# EAGLE design USB_Isolator (EAGLE 7.7.0)
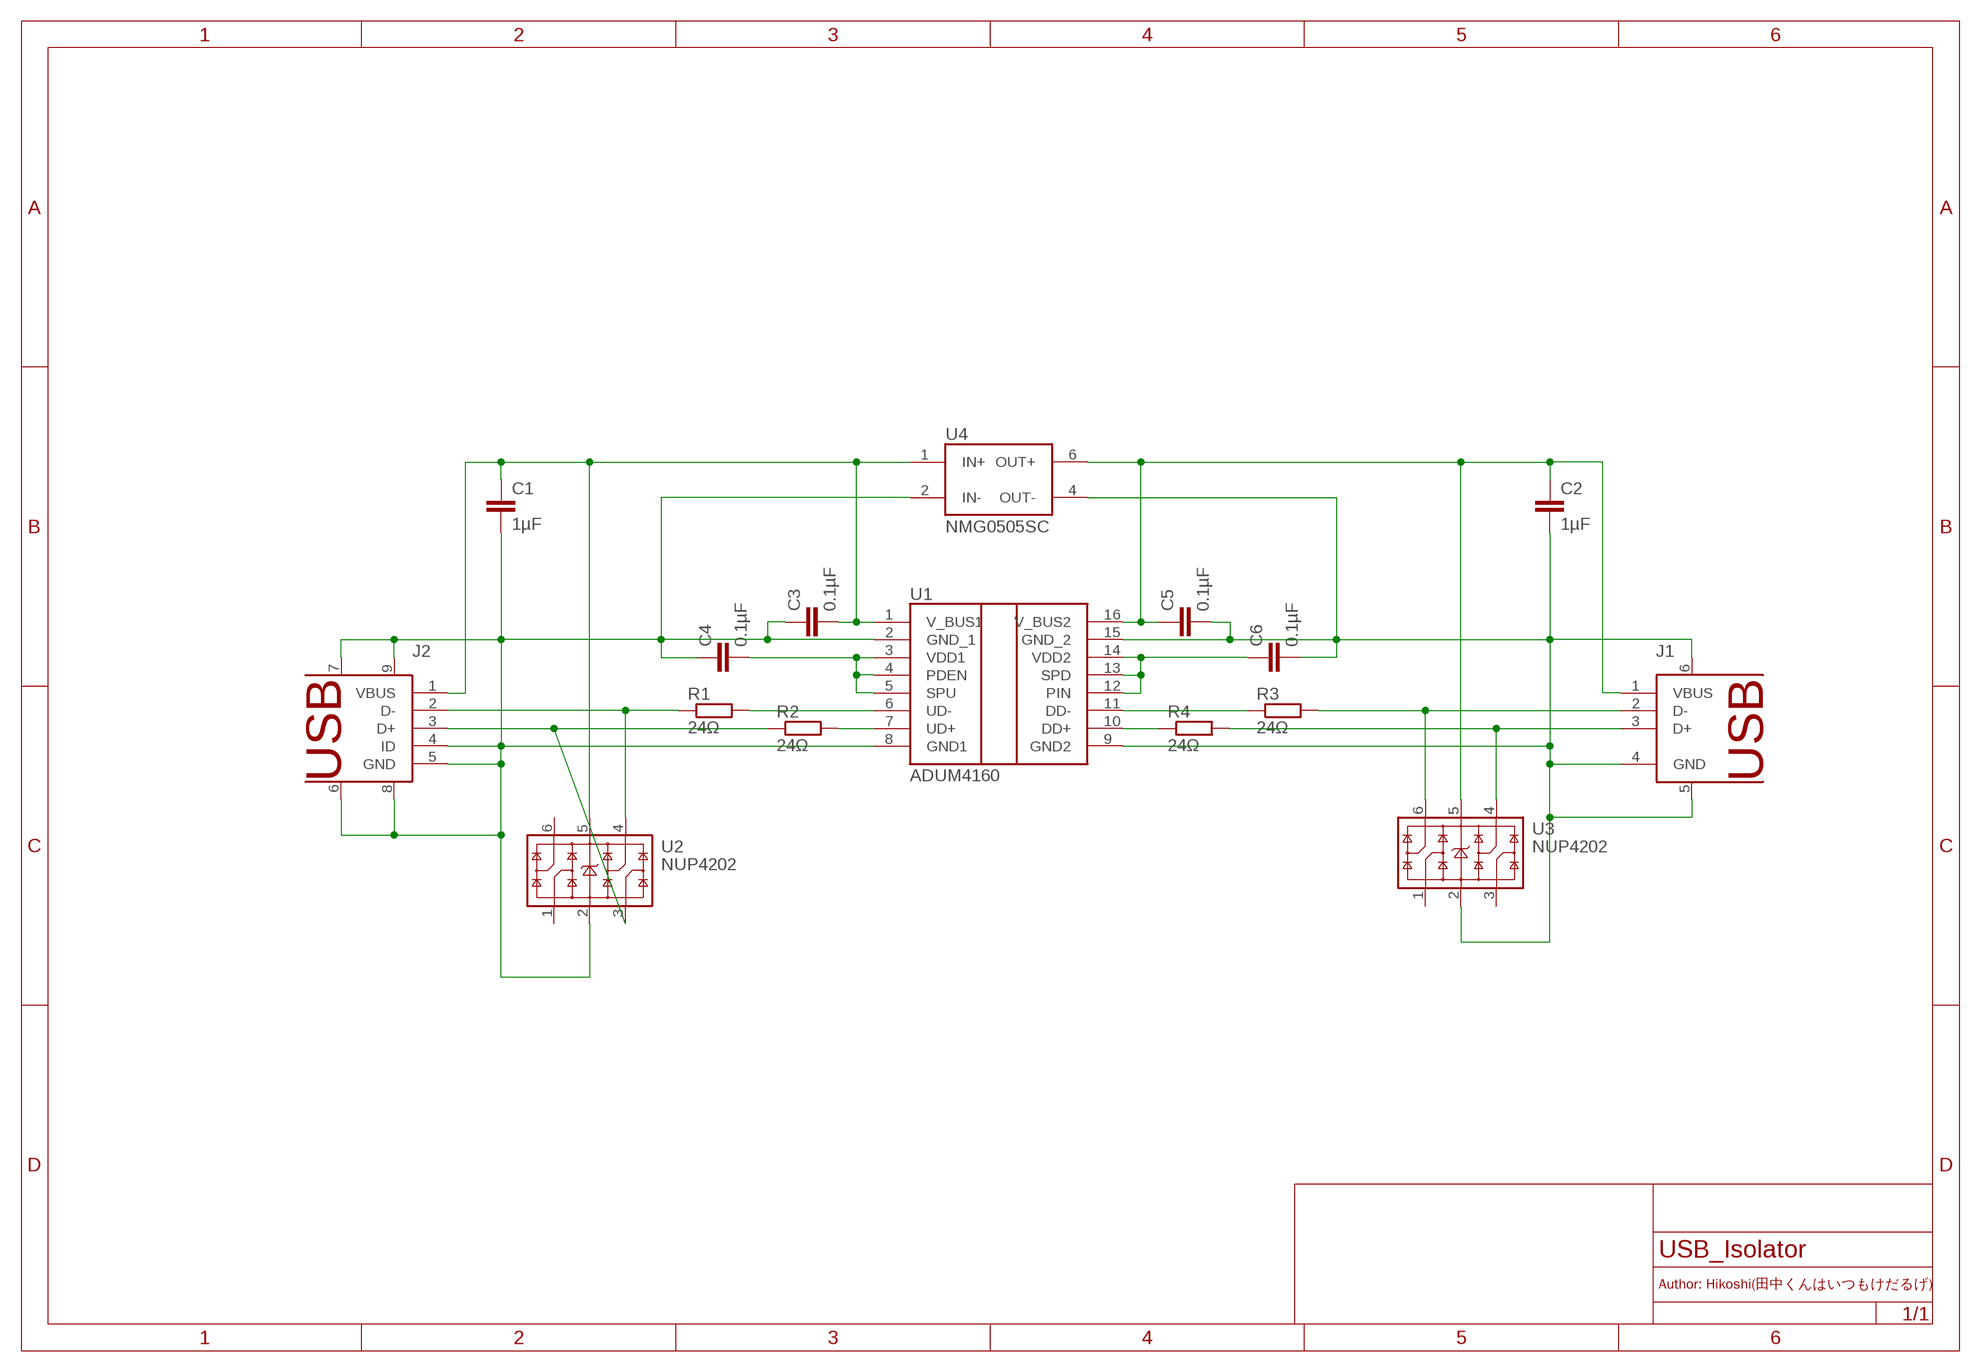
[diagram p0: schematic, sheet 1]

## Parts
C1  1µF  CAPACITOR0805  [C0805]
C2  1µF  CAPACITOR0805  [C0805]
C3  0.1µF  CAPACITOR0402  [C0402]
C4  0.1µF  CAPACITOR0402  [C0402]
C5  0.1µF  CAPACITOR0402  [C0402]
C6  0.1µF  CAPACITOR0402  [C0402]
J1  USB_A  [USB_A_F]
J2  USB_MINI  [USB_MINI]
R1  24Ω  RESISTOR0402  [R0402]
R2  24Ω  RESISTOR0402  [R0402]
R3  24Ω  RESISTOR0402  [R0402]
R4  24Ω  RESISTOR0402  [R0402]
U1  ADUM4160  [SOIC_W-28]
U2  NUP4202  [SOT-363]
U3  NUP4202  [SOT-363]
U4  NMG0505SC  [NMG]

## Nets
DD_N [USB]: J1.2(D-) R3.2 U3.6(IO6)
DD_P [USB]: J1.3(D+) R4.2 U3.4(IO4)
DGND [Power]: C2.2 C5.2 C6.2 J1.4(GND) J1.5(SHIELD1) J1.6(SHIELD2) U1.9(GND2) U1.15(GND_2) U3.2(VN) U4.4(OUT-)
DVBUS [Power]: C2.1 C5.1 J1.1(VBUS) U1.16(V_BUS2) U3.5(VP) U4.6(OUT+)
DVDD: C6.1 U1.12(PIN) U1.13(SPD) U1.14(VDD2)
N$1: R2.2 U1.7(UD+)
N$3: R1.2 U1.6(UD-)
N$8: R4.1 U1.10(DD+)
N$9: R3.1 U1.11(DD-)
UD_N [USB]: J2.2(D-) R1.1 U2.4(IO4)
UD_P [USB]: J2.3(D+) R2.1 U2.3(IO3)
UGND [Power]: C1.2 C3.1 C4.1 J2.4(ID) J2.5(GND) J2.6(SHIELD1) J2.7(SHIELD2) J2.8(SHIELD3) J2.9(SHIELD4) U1.2(GND_1) U1.8(GND1) U2.2(VN) U4.2(IN-)
UVBUS [Power]: C1.1 C3.2 J2.1(VBUS) U1.1(V_BUS1) U2.5(VP) U4.1(IN+)
UVDD: C4.2 U1.3(VDD1) U1.4(PDEN) U1.5(SPU)
Unconnected: U2.1(IO1) U2.6(IO6) U3.1(IO1) U3.3(IO3)

## Notes on the sheet
- Author: Hikoshi(田中くんはいつもけだるげ)

## Library data of the parts
C1-C6 = USB_Isolator:CAPACITOR
J1 = USB_Isolator:USB_A
J2 = USB_Isolator:USB_MINI
R1-R4 = USB_Isolator:RESISTOR
U1 = USB_Isolator:ADUM4160
U2 U3 = USB_Isolator:NUP4202
U4 = USB_Isolator:NMG0505SC

## Net classes
1 USB: width 0.381 mm, drill 0.254 mm, clearance 0.254 mm
2 Power: width 0.508 mm, drill 0.508 mm, clearance 0.762 mm

## Board
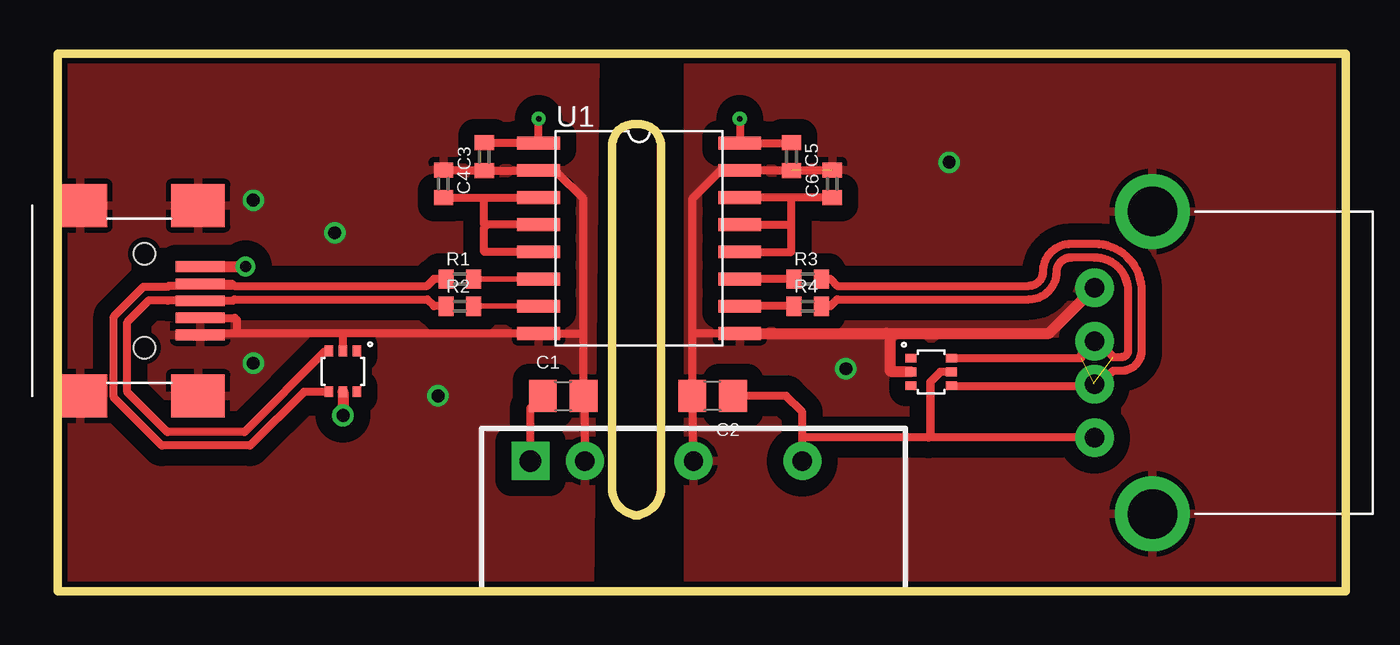
[diagram p1: board, top side]
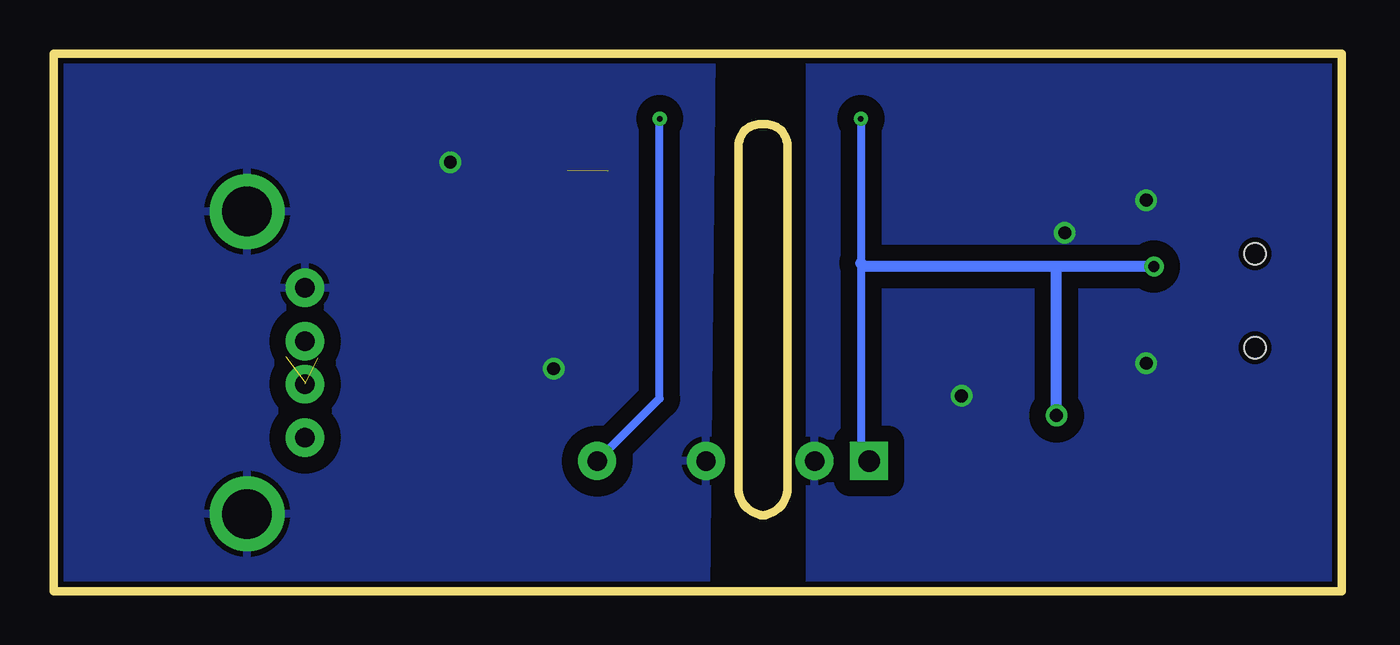
[diagram p2: board, bottom side, seen from below]

Size 60.2 x 25.15 mm. Coordinates in mm from the lower left corner, seen from the top.
Outline: 60.12,0 60.12,25.14 0,25.14
Outline: 0,25.14 0,25.15 60.2,25.15 60.2,0 60.12,0
Outline: 0,25.14 0,0 60.12,0
Outline: 25.91,20.83 arc-90 26.92,21.84 27.18,21.84 arc-90 28.19,20.83 28.19,4.83 arc-90 26.92,3.56 27.18,3.56 arc-90 25.91,4.83 25.91,20.83
Copper layers (1*16): Top 0.035mm / dielectric 1.5mm / Bottom 0.035mm
Design rules "default *": minimum track width 10mil, minimum drill 10mil, track to track 6mil, track to pad 5mil, pad to pad 5mil, via to via 5mil, smd to smd 8mil, copper to edge 10mil, drill to drill 8mil, minimum pad ring 10mil, minimum via ring 8mil, stop-mask expansion 6mil, vias tented up to drill 0mil, thermal gap 10mil

### Footprints (pad centres in the part's own frame; a part is rotated, then mirrored left to right if it is on the bottom)
C0805 = smd 1.3 x 1.5: 1 -0.95,0; 2 0.95,0
C0402 = smd 0.7 x 0.9: 1 -0.65,0; 2 0.65,0
USB_A_F = drill 0.91 pad 1.8: 1 -3.5,2.71; 2 -1,2.71; 3 1,2.71; 4 3.5,2.71 | drill 2.31 pad 3.5: 5 -7.07,0; 6 7.07,0
USB_MINI = smd 0.5 x 2.3: 1 -1.6,2.6; 2 -0.8,2.6; 3 0,2.6; 4 0.8,2.6; 5 1.6,2.6 | smd 2 x 2.5: 6 -4.45,2.5; 7 4.45,2.5; 8 -4.45,-3; 9 4.45,-3 | hole 1: -2.2,0; 2.2,0
R0402 = smd 0.7 x 0.9: 1 -0.65,0; 2 0.65,0
SOIC_W-28 = smd 2 x 0.6: 1 -4.7,4.445; 2 -4.7,3.175; 3 -4.7,1.905; 4 -4.7,0.635; 5 -4.7,-0.635; 6 -4.7,-1.905; 7 -4.7,-3.175; 8 -4.7,-4.445; 9 4.7,-4.445; 10 4.7,-3.175; 11 4.7,-1.905; 12 4.7,-0.635; 13 4.7,0.635; 14 4.7,1.905; 15 4.7,3.175; 16 4.7,4.445
SOT-363 = smd 0.5 x 0.4: 1 -0.95,0.65; 2 -0.95,0; 3 -0.95,-0.65; 4 0.95,-0.65; 5 0.95,0; 6 0.95,0.65
NMG = drill 1 pad 1.778 square: 1 -7.62,0 | drill 0.9 pad 1.778: 2 -5.08,0; 4 0,0; 6 5.08,0

### Placement (x,y rotation side)
C1  23.62,9.14 0 top
C2  30.61,9.14 180 top
C3  19.94,20.32 90 top
C4  18.03,19.05 270 top
C5  34.29,20.32 270 top
C6  36.2,19.05 90 top
J1  51.16,10.69 90 top
J2  4.06,13.59 270 top
R1  18.8,14.61 0 top
R2  18.8,13.34 0 top
R3  35.05,14.61 0 top
R4  35.05,13.34 0 top
U1  27.18,16.51 0 top
U2  13.34,10.29 270 top
U3  40.82,10.26 0 top
U4  29.72,6.1 0 top

### Tracks (layer width: path | path; a pad name or v marks a point on that pad's centre or on a via)
DD_N  (1 unrouted)
  Top 0.381: R3.2 36.11,14.61 36.42,14.29 45.39,14.29 arc90 46.04,14.94 arc-90 47.35,16.24 48.46,16.24 arc-90 50.66,14.05 50.66,11.28 arc-90 49.71,10.33 49.33,10.33 48.7,9.69 J1.2 | U3.6 47.83,10.91 47.83,11.06 48.39,11.63
DD_P  (1 unrouted)
  Top 0.381: R4.2 36.11,13.34 36.42,13.65 45.39,13.65 arc90 46.67,14.94 arc-90 47.35,15.61 48.46,15.61 arc-90 50.02,14.05 50.02,11.28 arc-90 49.71,10.96 49.33,10.96 48.59,11.69 J1.3 | U3.4 48.28,9.61 48.39,9.72
DGND  (via drill 0.6)  (1 unrouted)
  Top 0.381: C6.2 36.18,19.68 U1.15 30.99,19.68 29.66,18.35 29.66,11.94 | U4.4 29.66,6.16 C2.2 29.66,11.94 | U1.9 29.78,12.07 29.66,11.94
  Top 0.508: U1.9 38.71,12.07 | 38.71,12.07 46.32,12.07 J1.4 | U3.2 38.96,10.26 38.91,10.31 38.91,11.86 38.71,12.07
  other vias: 36.83,10.41 41.66,20.07
  pour Top: 29.46,25.15 29.46,0 60.2,0 60.2,25.15
  pour Bottom: 29.46,25.15 29.72,0 60.2,0 60.2,24.89 59.94,25.15
DVBUS  (via drill 0.25)
  Top 0.381: C5.1 34.27,20.95 U1.16 v31.88,22.1 | U4.6 34.8,7.14 | 34.8,7.14 34.8,8.38 34.04,9.14 C2.1 | J1.1 40.69,7.19 34.85,7.19 34.8,7.14 | U3.5 41.25,10.26 40.79,9.8
  Top 0.406: 40.79,9.8 40.79,7.29 40.69,7.19
  Bottom 0.381: U4.6 31.88,9.02 v31.88,22.1
DVDD
  Top 0.381: C6.1 34.29,18.4 | 34.29,18.4 31.89,18.4 U1.14 | U1.13 34.29,17.14 | 34.29,17.14 34.29,18.4 | U1.12 34.29,15.88 34.29,17.14
N$1
  Top 0.254: U1.7 R2.2
N$2  (via drill 0.25)
  other vias: 13.34,8.26
N$3
  Top 0.254: R1.2 U1.6
N$8
  Top 0.381: R4.1 U1.10
N$9
  Top 0.381: R3.1 U1.11
UD_N
  Top 0.381: J2.2 8.15,14.39 8.26,14.29 | 8.26,14.29 17.27,14.29 17.59,14.61 R1.1 | U2.4 11.51,9.34 9,6.82 4.87,6.82 2.63,9.06 2.63,12.86 4.01,14.24 5.16,14.24 5.21,14.29 8.26,14.29
UD_P
  Top 0.381: R2.1 17.59,13.34 17.27,13.65 8.26,13.65 8.19,13.59 J2.3 5.17,13.59 5.16,13.6 4.27,13.6 3.26,12.59 3.26,9.33 5.13,7.46 8.73,7.46 12.52,11.24 U2.3
UGND  (via drill 0.6)
  Top 0.381: C4.1 18.06,19.67 C3.1 22.46,19.67 U1.2 22.6,19.56 23.37,19.56 24.57,18.35 24.57,12.07 | U4.2 24.64,9.08 C1.2 24.57,12.07 | 24.57,12.07 U1.8 13.34,12.07 | 13.34,12.07 8.38,12.07 | 8.38,12.07 6.74,12.07 J2.5 | J2.4 8.29,12.79 8.38,12.7 8.38,12.07 | U2.2 13.34,12.07
  other vias: 12.95,16.76 9.14,18.29 17.78,9.14 9.14,10.67
  pour Top: 0,25.15 25.15,25.15 24.89,0 0,0
  pour Bottom (isolate 0.254): 24.89,25.15 24.89,0 0,0 0,25.15
UVBUS  (via drill 0.25, 0.51, 0.61)
  Top 0.381: C3.2 19.95,20.95 U1.1 v22.48,22.1 | U4.1 22.1,8.57 C1.1
  Top 0.508: J2.1 v8.79,15.19 | v8.79,15.19 | U2.5 v13.34,8.23
  Bottom 0.381: v22.48,22.1 22.48,15.34 22.48,6.48 U4.1
  Bottom 0.508: v8.79,15.19 13.23,15.19 | 13.23,15.19 22.33,15.19 22.48,15.34 | v13.34,8.23 13.34,15.09 13.23,15.19
UVDD
  Top 0.381: C4.2 19.94,18.4 | 19.94,18.4 22.46,18.4 U1.3 | U1.4 20.07,17.14 | 20.07,17.14 19.94,17.14 19.94,18.4 | U1.5 19.94,15.88 19.94,17.02 20.07,17.14